# EAGLE design MirOculousShieldv2 (EAGLE 6.6.0)
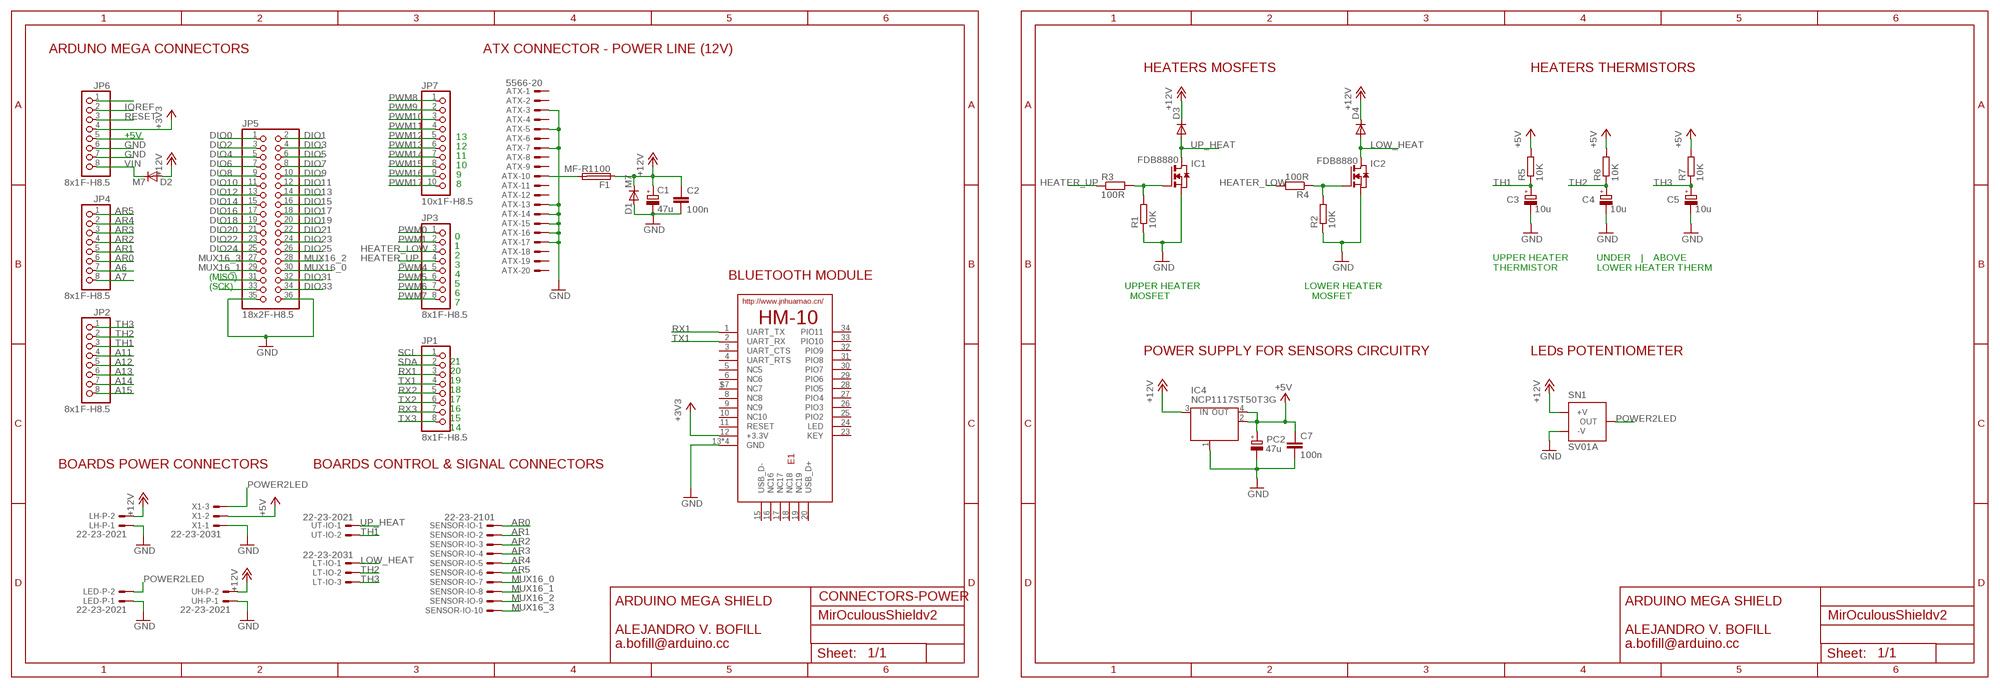
[diagram p0: schematic, sheet 1]

## Parts
ATX  5566-20  [5566-20]
C1  47u  CPOL-EUD  [PANASONIC_D]
C2  100n  C-EUC0603  [C0603]
C3  10u  CPOL-EUA/3216-18R  [A/3216-18R]
C4  10u  CPOL-EUA/3216-18R  [A/3216-18R]
C5  10u  CPOL-EUA/3216-18R  [A/3216-18R]
C7  100n  C-EUC0603  [C0603]
D1  M7  DIODE-SMB  [SMB]
D2  M7  DIODE-SMB  [SMB]
D3  RGL34A  DO-213_DIODE  [DO-213AA_DIODE]
D4  RGL34A  DO-213_DIODE  [DO-213AA_DIODE]
E1  HM-10-BOARD  [26.9X13X2.2_BOARD]
F1  MF-R1100  LITTLEFUSE  [LITTLEFUSE]
IC1  FDB8880  [FDB8880]
IC2  FDB8880  [FDB8880]
IC4  NCP1117ST50T3G  MC33269ST-3.3T3  [SOT223]
JP1  8x1F-H8.5  PINHD-1X8  [1X08]
JP2  8x1F-H8.5  PINHD-1X8  [1X08]
JP3  8x1F-H8.5  PINHD-1X8  [1X08]
JP4  8x1F-H8.5  PINHD-1X8  [1X08]
JP5  18x2F-H8.5  PINHD-2X18  [2X18]
JP6  8x1F-H8.5  PINHD-1X8  [1X08]
JP7  10x1F-H8.5  PINHD-1X10_ARD  [1X10]
LED-P  22-23-2021  [22-23-2021]
LH-P  22-23-2021  [22-23-2021]
LT-IO  22-23-2031  [22-23-2031]
PC2  47u  CPOL-EUD  [PANASONIC_D]
R1  10K  R-EU_R0603  [R0603]
R2  10K  R-EU_R0603  [R0603]
R3  100R  R-EU_R0603  [R0603]
R4  100R  R-EU_R0603  [R0603]
R5  10K  R-EU_R0603  [R0603]
R6  10K  R-EU_R0603  [R0603]
R7  10K  R-EU_R0603  [R0603]
SENSOR-IO  22-23-2101  [22-23-2101]
SN1  SV01A  [SV01A]
UH-P  22-23-2021  [22-23-2021]
UT-IO  22-23-2021  [22-23-2021]
X1  22-23-2031  [22-23-2031]

## Nets
+3V3 [power usb]: E1.12(+3.3V) JP6.4
+5V: C7.1 IC4.2(OUT) IC4.4(OUT) PC2.+ R5.2 R6.2 R7.2 X1.2
+12V [power12]: C1.+ C2.1 D1.C D2.A D3.P$2(C) D4.P$2(C) F1.1 IC4.3(IN) LH-P.2 SN1.3(+V) UH-P.2
A6: JP4.7
A7: JP4.8
A11: JP2.4
A12: JP2.5
A13: JP2.6
A14: JP2.7
A15: JP2.8
AR0: JP4.6 SENSOR-IO.1
AR1: JP4.5 SENSOR-IO.2
AR2: JP4.4 SENSOR-IO.3
AR3: JP4.3 SENSOR-IO.4
AR4: JP4.2 SENSOR-IO.5
AR5: JP4.1 SENSOR-IO.6
DIO0: JP5.1
DIO1: JP5.2
DIO2: JP5.3
DIO3: JP5.4
DIO4: JP5.5
DIO5: JP5.6
DIO6: JP5.7
DIO7: JP5.8
DIO8: JP5.9
DIO9: JP5.10
DIO10: JP5.11
DIO11: JP5.12
DIO12: JP5.13
DIO13: JP5.14
DIO14: JP5.15
DIO15: JP5.16
DIO16: JP5.17
DIO17: JP5.18
DIO18: JP5.19
DIO19: JP5.20
DIO20: JP5.21
DIO21: JP5.22
DIO22: JP5.23
DIO23: JP5.24
DIO24: JP5.25
DIO25: JP5.26
DIO30: JP5.31
DIO31: JP5.32
DIO32: JP5.33
DIO33: JP5.34
GND [gnd]: ATX.3 ATX.5 ATX.7 ATX.13 ATX.14 ATX.15 ATX.16 ATX.17 C1.- C2.2 C3.- C4.- C5.- C7.2 D1.A E1.13(GND) E1.14(GND) E1.21(GND) E1.22(GND) IC1.3(S) IC2.3(S) IC4.1(GND/ADJ) JP5.35 JP5.36 JP6.6 JP6.7 LED-P.1 LH-P.1 PC2.- R1.1 R2.1 SN1.1(-V) UH-P.1 X1.1
HEATER_LOW: JP3.3 R4.2
HEATER_UP: JP3.4 R3.1
IOREF: JP6.2
LOW_HEAT [power12]: D4.P$1(A) IC2.2(D) LT-IO.1
MUX16_0: JP5.30 SENSOR-IO.7
MUX16_1: JP5.29 SENSOR-IO.8
MUX16_2: JP5.28 SENSOR-IO.9
MUX16_3: JP5.27 SENSOR-IO.10
N$1: JP6.1
N$2: JP6.5
N$17 [power12]: ATX.10 F1.2
N$18: IC1.1(G) R1.2 R3.2
N$19: IC2.1(G) R2.2 R4.1
POWER2LED [power12]: LED-P.2 SN1.2(OUT) X1.3
PWM0: JP3.1
PWM1: JP3.2
PWM4: JP3.5
PWM5: JP3.6
PWM6: JP3.7
PWM7: JP3.8
PWM8: JP7.1
PWM9: JP7.2
PWM10: JP7.3
PWM11: JP7.4
PWM12: JP7.5
PWM13: JP7.6
PWM14: JP7.7
PWM15: JP7.8
PWM16: JP7.9
PWM17: JP7.10
RESET: JP6.3
RX1: E1.1(UART_TX) JP1.3
RX2: JP1.5
RX3: JP1.7
SCL: JP1.1
SDA: JP1.2
TH1: C3.+ JP2.3 R5.1 UT-IO.2
TH2: C4.+ JP2.2 LT-IO.2 R6.1
TH3: C5.+ JP2.1 LT-IO.3 R7.1
TX1: E1.2(UART_RX) JP1.4
TX2: JP1.6
TX3: JP1.8
UP_HEAT [power12]: D3.P$1(A) IC1.2(D) UT-IO.1
VIN: D2.C JP6.8
Unconnected: ATX.1 ATX.2 ATX.4 ATX.6 ATX.8 ATX.9 ATX.11 ATX.12 ATX.18 ATX.19 ATX.20 E1.3(UART_CTS) E1.4(UART_RTS) E1.5(NC5) E1.6(NC6) E1.8(NC8) E1.9(NC9) E1.10(NC10) E1.11(RESET) E1.15(USB_D-) E1.16(NC16) E1.17(NC17) E1.18(NC18) E1.19(NC19) E1.20(USB_D+) E1.23(KEY) E1.24(LED) E1.25(PIO2) E1.26(PIO3) E1.27(PIO4) E1.28(PIO5) E1.29(PIO6) E1.30(PIO7) E1.31(PIO8) E1.32(PIO9) E1.33(PIO10) E1.34(PIO11) E1.$7(NC7)

## Notes on the sheet
- ARDUNO MEGA CONNECTORS | ATX CONNECTOR - POWER LINE (12V)
- HEATERS MOSFETS | HEATERS THERMISTORS
- +5V | 13
- 12
- 11
- 10
- 9
- 8
- 0
- 1
- 2
- 3
- 4
- UPPER HEATER
  THERMISTOR
- UNDER    |    ABOVE
  LOWER HEATER THERM
- (MISO) | 5 | BLUETOOTH MODULE
- (SCK) | 6
- 7
- UPPER HEATER
    MOSFET
- LOWER HEATER
     MOSFET
- 21 | POWER SUPPLY FOR SENSORS CIRCUITRY | LEDs POTENTIOMETER
- 20
- 19
- 18
- 17
- 16
- 15
- 14
- BOARDS POWER CONNECTORS | BOARDS CONTROL & SIGNAL CONNECTORS
- CONNECTORS-POWER
- ARDUINO MEGA SHIELD
  
  ALEJANDRO V. BOFILL
  a.bofill@arduino.cc
- ARDUINO MEGA SHIELD
  
  ALEJANDRO V. BOFILL
  a.bofill@arduino.cc

## Library data of the parts
ATX = con-molex:5566-20: Mini FIT connector 20 pol ATX PC-Motherboard Power connector Source: http://www.molex.com; OC_FARNELL: 9734252; OC_NEWARK: unknown
C1 C3-C5 PC2 = rcl:CPOL-EU: POLARIZED CAPACITOR, European symbol
C2 C7 = rcl:C-EU: CAPACITOR, European symbol
D1 D2 = diode:DIODE-: DIODE
D3 D4 = verkstad:DO-213_DIODE: RGL34A thru RGL34K Surface Mount Glass Passivated Junction Fast Switching Rectifier
E1 = JNHuaMao:HM-10: HM Bluetooth module use TI CC2540 or CC2541, Master and slave roles in one, transmission version and remote control version and PIO state acquisition functions in one, Support the AT command modify module parameters, Convenient and flexible.
F1 = fuse:LITTLEFUSE: LITTLEFUSE Picofuse/slow Littlefuse; FARNELL: 1652183; OC_FARNELL: unknown; OC_NEWARK: unknown
IC1 IC2 = verkstad:FDB8880: FDB8880 N-Channel PowerTrench MOSFET This N-Channel MOSFET has been designed specifically to improve the overall efficiency of DC/DC converters using either synchronous or conventional switching PWM controllers. It has been optimized for low gate charge, low rDS(ON) and fast switching speed. Digikey Part Number: FDD8880CT-ND
IC4 = linear:MC33269ST*: Adjustable Output Low Dropout Voltage Regulator 800 mA Source: http://www.onsemi.com/pub/Collateral/MC33269-D.PDF
JP1-JP4 JP6 = SmartPrj:PINHD-1X8: PIN HEADER
JP5 = SmartPrj:PINHD-2X18: PIN HEADER
JP7 = SmartPrj:PINHD-1X10_ARD: PIN HEADER
LED-P LH-P UH-P UT-IO = con-molex:22-23-2021: .100" (2.54mm) Center Header - 2 Pin; MF: MOLEX; MPN: 22-23-2021; OC_FARNELL: 1462926; OC_NEWARK: 25C3832
LT-IO X1 = con-molex:22-23-2031: .100" (2.54mm) Center Header - 3 Pin; MF: MOLEX; MPN: 22-23-2031; OC_FARNELL: 1462950; OC_NEWARK: 30C0862
R1-R7 = rcl:R-EU_: RESISTOR, European symbol
SENSOR-IO = con-molex:22-23-2101: .100" (2.54mm) Center Header - 10 Pin; MF: MOLEX; MPN: 22-23-2101; OC_FARNELL: 1756828; OC_NEWARK: 94C0765
SN1 = murata-sensor:SV01: Rotary Position Sensors SMD/Lead Dust-proof Type 12mm Size SV01 Series Source: http://www.murata.com/catalog/r50/el0595.pdf; OC_FARNELL: 1406648; OC_NEWARK: unknown

## Net classes
0 default: width 0.254 mm, drill 0.406 mm, clearance 0.203 mm
1 power: width 0.61 mm, drill 0.406 mm, clearance 0.203 mm
2 gnd: width 0.305 mm, drill 0.406 mm, clearance 0.203 mm
3 power usb: width 0.508 mm, drill 0.406 mm, clearance 0.203 mm
4 power12: width 1.905 mm, drill 0.813 mm, clearance 0.203 mm

## Board
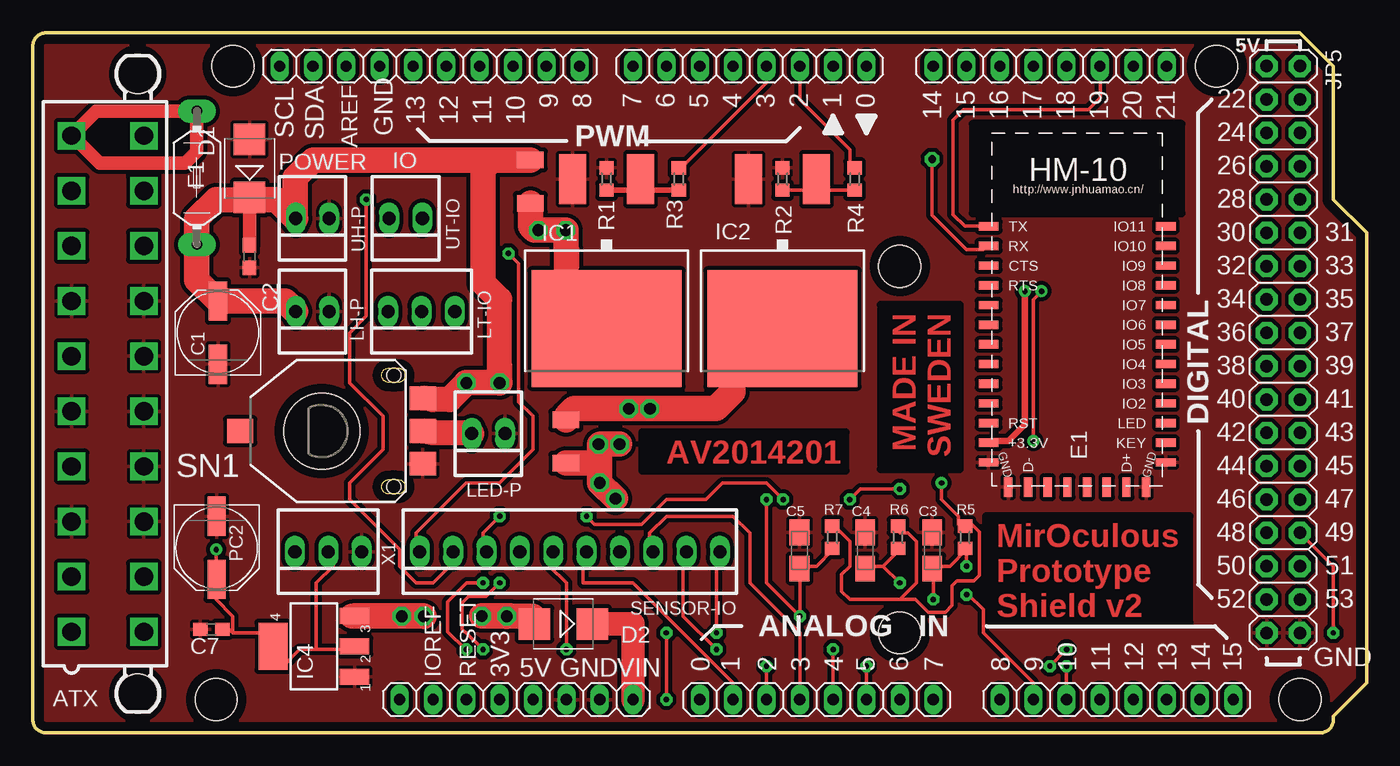
[diagram p1: board, top side]
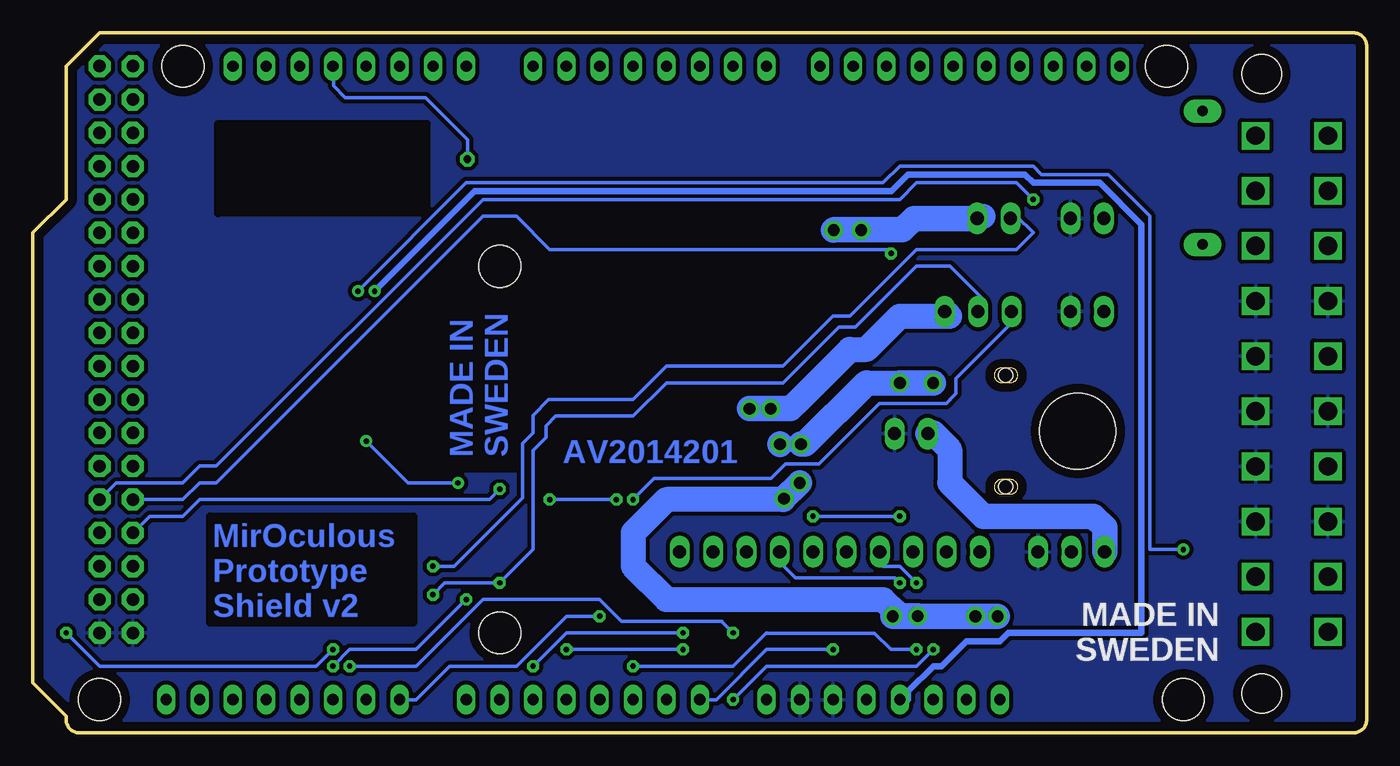
[diagram p2: board, bottom side, seen from below]

Size 101.6 x 53.34 mm. Coordinates in mm from the lower left corner, seen from the top.
Outline: 96.52,53.34 99.06,50.8 99.06,40.64 101.6,38.1 101.6,3.81 99.06,1.27 99.06,1 arc-90 98.06,0 1,0 arc-90 0,1 0,52.34 arc-90 1,53.34 96.52,53.34
Copper layers (1*16): Top 0.035mm / dielectric 1.5mm / Bottom 0.035mm
Design rules "default": minimum track width 8mil, minimum drill 16mil, track to track 7mil, track to pad 7mil, pad to pad 8mil, via to via 10mil, smd to smd 7mil, copper to edge 27mil, drill to drill 12mil, minimum pad ring 10mil, minimum via ring 10mil, stop-mask expansion 2mil, vias tented up to drill 24mil, thermal gap 10mil
Holes 3.2 mm at 96.52,2.54 15.24,50.8 90.17,50.8 13.97,2.54 66.04,35.56 66.04,7.62
tRestrict: area 64.6,20.1 to 70.6,32.6; area 46.4,20 to 61.9,22.9; area 72.6,8.4 to 88.1,16.5; area 71.6,39.6 to 87.5,46.4
bRestrict: area 64.6,20.1 to 70.6,32.6; area 46.4,20 to 61.9,22.9; area 72.6,8.4 to 88.1,16.5; area 71.6,39.6 to 87.5,46.4

### Footprints (pad centres in the part's own frame; a part is rotated, then mirrored left to right if it is on the bottom)
5566-20 = drill 1.4 square: 1 18.9,-2.75; 2 14.7,-2.75; 3 10.5,-2.75; 4 6.3,-2.75; 5 2.1,-2.75; 6 -2.1,-2.75; 7 -6.3,-2.75; 8 -10.5,-2.75; 9 -14.7,-2.75; 10 -18.9,-2.75; 11 18.9,2.75; 12 14.7,2.75; 13 10.5,2.75; 14 6.3,2.75; 15 2.1,2.75; 16 -2.1,2.75; 17 -6.3,2.75; 18 -10.5,2.75; 19 -14.7,2.75; 20 -18.9,2.75 | hole 3: 23.6,2.29; -23.6,2.29
PANASONIC_D = smd 3 x 1.4: + 2.4,0; - -2.4,0
C0603 = smd 1.1 x 1: 1 -0.85,0; 2 0.85,0
A/3216-18R = smd 1.95 x 1.5: + 1.375,0; - -1.375,0
SMB = smd 2.4 x 2.4: A 2.2,0; C -2.2,0
DO-213AA_DIODE = smd 1.27 x 2.032: P$1 -1.651,0; P$2 1.651,0
26.9X13X2.2_BOARD = smd 1.5 x 0.635: 1 -7.5,0; 2 -7.5,-1.5; 3 -7.5,-3; 4 -7.5,-4.5; 5 -7.5,-6; 6 -7.5,-7.5; 8 -7.5,-10.5; 9 -7.5,-12; 10 -7.5,-13.5; 11 -7.5,-15; 12 -7.5,-16.5; 13 -7.5,-18; 22 6,-18; 23 6,-16.5; 24 6,-15; 25 6,-13.5; 26 6,-12; 27 6,-10.5; 28 6,-9; 29 6,-7.5; 30 6,-6; 31 6,-4.5; 32 6,-3; 33 6,-1.5; 34 6,0; $7 -7.5,-9 | smd 0.635 x 1.5: 14 -6,-19.875; 15 -4.5,-19.875; 16 -3,-19.875; 17 -1.5,-19.875; 18 0,-19.875; 19 1.5,-19.875; 20 3,-19.875; 21 4.5,-19.875
LITTLEFUSE = drill 0.813 pad 1.778 long: 1 -5.08,0; 2 5.08,0
FDB8880 = smd 2.032 x 3.81: 1 -2.595,-8.89; 3 2.595,-8.89 | smd 11.43 x 8.89: 2 0,2.5
SOT223 = smd 1.219 x 2.235: 1 -2.311,-3.099; 2 0,-3.099; 3 2.311,-3.099 | smd 3.6 x 2.2: 4 0,3.099
1X08 = drill 0.85 pad 1.422 long: 1 -8.89,0; 2 -6.35,0; 3 -3.81,0; 4 -1.27,0; 5 1.27,0; 6 3.81,0; 7 6.35,0; 8 8.89,0
2X18 = drill 0.95 pad 1.676 octagon: 1 -21.59,-1.27; 2 -21.59,1.27; 3 -19.05,-1.27; 4 -19.05,1.27; 5 -16.51,-1.27; 6 -16.51,1.27; 7 -13.97,-1.27; 8 -13.97,1.27; 9 -11.43,-1.27; 10 -11.43,1.27; 11 -8.89,-1.27; 12 -8.89,1.27; 13 -6.35,-1.27; 14 -6.35,1.27; 15 -3.81,-1.27; 16 -3.81,1.27; 17 -1.27,-1.27; 18 -1.27,1.27; 19 1.27,-1.27; 20 1.27,1.27; 21 3.81,-1.27; 22 3.81,1.27; 23 6.35,-1.27; 24 6.35,1.27; 25 8.89,-1.27; 26 8.89,1.27; 27 11.43,-1.27; 28 11.43,1.27; 29 13.97,-1.27; 30 13.97,1.27; 31 16.51,-1.27; 32 16.51,1.27; 33 19.05,-1.27; 34 19.05,1.27; 35 21.59,-1.27; 36 21.59,1.27
1X10 = drill 0.85 pad 1.422 long: 1 -11.43,0; 2 -8.89,0; 3 -6.35,0; 4 -3.81,0; 5 -1.27,0; 6 1.27,0; 7 3.81,0; 8 6.35,0; 9 8.89,0; 10 11.43,0
22-23-2021 = drill 1 long: 1 -1.27,0; 2 1.27,0
22-23-2031 = drill 1 long: 1 -2.54,0; 2 0,0; 3 2.54,0
R0603 = smd 1 x 1.1: 1 -0.85,0; 2 0.85,0
22-23-2101 = drill 1 long: 1 -11.43,0; 2 -8.89,0; 3 -6.35,0; 4 -3.81,0; 5 -1.27,0; 6 1.27,0; 7 3.81,0; 8 6.35,0; 9 8.89,0; 10 11.43,0
SV01A = smd 1.8 x 2: 1 -2.5,-7.7; 2 0,-7.7; 2@1 0,6.2; 3 2.5,-7.7 | hole 5.8: 0,0 | hole 1.1: 4.25,-5.5; -4.25,-5.5

### Placement (x,y rotation side)
ATX  5.7,26.6 270 top
C1  14.1,30.5 90 top
C2  16.5,36.3 270 top
C3  68.5,13.9 270 top
C4  63.4,13.9 270 top
C5  58.4,13.9 270 top
C7  13.6,7.9 180 top
D1  16.5,43 90 top
D2  40.4,8.3 180 top
D3  37.9,42 90 top
D4  40.6,22.2 270 top
E1  80.3,38.6 0 top
F1  12.5,42.3 90 top
IC1  43.7,33.3 180 top
IC2  57.1,33.3 180 top
IC4  21.4,6.6 90 top
JP1  77.47,50.8 180 top
JP2  82.55,2.54 0 top
JP3  54.61,50.8 180 top
JP4  59.69,2.54 0 top
JP5  95.25,29.21 270 top
JP6  36.83,2.54 0 top
JP7  30.23,50.8 0 top
LED-P  34.7,22.8 180 top
LH-P  21.3,32.1 180 top
LT-IO  29.6,32.1 180 top
PC2  14,14.1 270 top
R1  43.7,42.2 270 top
R2  57.1,42.2 270 top
R3  49.2,42.2 270 top
R4  62.6,42.2 90 top
R5  71,14.9 90 top
R6  65.9,14.9 90 top
R7  60.9,14.9 90 top
SENSOR-IO  40.9,13.8 180 top
SN1  22,23 90 top
UH-P  21.3,39.2 180 top
UT-IO  28.4,39.2 180 top
X1  22.5,13.8 180 top

### Tracks (layer width: path | path; a pad name or v marks a point on that pad's centre or on a via)
+3V3  (via drill 0.41)
  Top 0.508: v75.56,33.66 75.56,23.5 74.3,22.23 73.03,22.23 E1.12
  Bottom 0.508: v75.56,33.66 67.94,41.27 36.2,41.27 34.92,42.55 26.04,42.55 25.4,41.91 20.32,41.91 17.14,38.73 17.14,7.62 27.3,7.62 27.94,6.99 30.48,6.99 32.38,5.08 33.02,5.08 34.92,3.17 34.92,2.54 JP6.4
+5V  (via drill 0.41)
  Top 0.203: 13.97,11.43 PC2.+
  Top 0.254: 13.97,11.43 13.97,10.16 15.24,8.89 15.24,7.62 | 21.59,6.35 20.32,6.35 19.05,5.08 17.78,5.08 17.78,6.35 IC4.4 17.78,7.62 15.24,7.62 | 21.59,6.35 24.13,6.35 IC4.2 | 21.59,6.35 21.59,11.43 22.86,12.7 X1.2 | 66.04,10.16 62.23,10.16 61.59,10.79 61.59,12.06 62.23,12.7 62.23,14.61 60.96,15.88 R7.2 | 66.04,10.16 67.31,11.43 67.31,14.61 66.67,15.24 66.04,15.24 66.04,15.88 R6.2 | 70.48,15.88 70.48,16.51 69.22,17.78 v69.22,19.05 | 70.48,15.88 R5.2 | v76.2,22.23 76.2,33.02 v76.83,33.66 | v13.97,13.97 13.97,12.06 PC2.+ | 70.48,15.88 71.53,15.88 72.1,15.3 72.1,12 71.7,11.6 70.4,11.6 70,11.2 70,9.7 69.5,9.2 68.2,9.2 67.24,10.16 66.04,10.16 | 15.24,7.62 14.96,7.9 C7.1
  Bottom 0.254: v69.22,19.05 73.03,19.05 v76.2,22.23 | v76.83,33.66 68.58,41.91 36.83,41.91 35.56,43.18 25.4,43.18 24.77,42.55 19.68,42.55 16.51,39.37 16.51,13.97 v13.97,13.97
+12V  (via drill 0.9)
  Top 0.203: v43.1,22 43.1,22.07 | 34.6,42.91 34.29,42.6
  Top 0.254: 43.1,22.07 42.63,22.54 44.16,22.54 v44.7,22
  Top 0.61: 33,26.7 33,26.69 v33.02,26.67
  Top 1.016: C2.1 D1.C
  Top 1.905: 13.97,40.64 16.51,40.64 D1.C | v36.1,8.89 38.1,8.89 D2.A | 24.3,8.89 IC4.3 | v33.02,26.67 31.75,25.4 30.48,25.4 SN1.3 | 34.29,34.29 35.56,33.02 35.56,27.94
  Top 1.93: 34.29,34.29 34.29,42.6 34.29,43 | 34.29,43 34.29,43.18 34.76,43.65 34.94,43.65 | 34.94,43.65 D3.P$2 21.35,43.65 20,42.3 20,39.2 UH-P.2 18.59,40.64 16.51,40.64 | 34.94,43.65 34.29,43 | IC4.3 29.78,8.91 v29.8,8.89 | v36.1,8.89 36.39,8.9 v34.2,8.9 | 43.18,21 v43.18,19.05 v44.38,17.85 | 43.18,21 43.18,21.9 | 43.18,21.9 43.18,21.99 | D4.P$2 43.13,20.55 43.18,21 | v44.7,22 43.28,22 43.18,21.9 | LH-P.2 19.23,32.9 C1.+ 12.5,34.5 F1.1 12.5,39.17 13.97,40.64 | 35.56,27.94 v35.56,26.67 | 33,26.7 35.6,26.7
  Bottom 0.254: 43.18,21.99 v44.69,21.99 | v44.7,22 v43.1,22 42.77,22
  Bottom 1.905: 38.1,26.67 v35.56,26.67 | 35.56,8.89 35.84,9.16 36.83,10.16 53.34,10.16 55.88,12.7 55.88,15.24 53.34,17.78 44.45,17.78 v43.18,19.05
  Bottom 1.93: v36.1,8.89 v29.8,8.89 v28.11,8.89 | v34.2,8.9 35.57,8.9 35.84,9.16 | v44.69,21.99 v44.7,22 | v35.56,26.67 v33.02,26.67 | 43.07,22 v43.1,22 | 38.1,26.67 42.77,22
AR0  (via drill 0.41)
  Top 0.254: v63.5,5.08 JP4.6 | v52.07,7.62 52.07,12.7 SENSOR-IO.1
  Bottom 0.254: v63.5,5.08 60.96,7.62 v52.07,7.62
AR1  (via drill 0.41)
  Top 0.254: v60.96,6.35 JP4.5 | v52.07,6.35 49.53,8.89 49.53,12.7 SENSOR-IO.2
  Bottom 0.254: v52.07,6.35 v60.96,6.35
AR2
  Top 0.254: JP4.4 58.42,7.62 54.61,11.43 54.61,15.24 53.34,16.51 48.26,16.51 46.99,15.24 46.99,13.97 SENSOR-IO.3
AR3  (via drill 0.41)
  Top 0.254: v55.88,5.08 JP4.3 | v35.56,11.43 34.53,10.4 33.2,10.4 32.7,9.9 32.7,7.9 32.9,7.7 32.94,7.7 v34.29,6.35
  Bottom 0.254: v55.88,5.08 48.26,5.08 45.72,7.62 45.7,7.6 37.5,7.6 36.25,6.35 v34.29,6.35 | v35.56,11.43 35.93,11.8 43.5,11.8 44.71,13.01 SENSOR-IO.4
AR4
  Top 0.254: JP4.2 53.34,3.81 45.72,11.43 41.91,11.43 41.91,12.7 SENSOR-IO.5
AR5  (via drill 0.41)
  Top 0.254: v40.64,6.35 40.64,11.43 39.37,12.7 SENSOR-IO.6
  Bottom 0.254: JP4.1 49.53,2.54 45.72,6.35 v40.64,6.35
GND
  pour Top (isolate 0.305, rank 2): 0.64,52.7 101.6,52.7 101.6,0.64 0.64,0.64 0.64,29.84 0.59,28.75 0.59,45.85 0.64,46.35
  pour Bottom (isolate 0.305, rank 2): 0.64,52.7 101.6,52.7 102.23,52.07 102.23,0.64 1.27,0.64 0.64,1.27 0.64,29.84 0.49,29.84 0.59,45.76 0.64,46.35
HEATER_LOW
  Top 0.254: JP3.3 58.42,48.26 62.23,44.45 62.23,43.18 R4.2
HEATER_UP
  Top 0.254: JP3.4 55.88,49.53 49.53,43.18 R3.1
LOW_HEAT  (via drill 0.9)
  Top 1.905: 53.34,26 53.34,29.21 55.88,31.75 IC2.2
  Top 1.93: 53.34,26 52.04,24.7 v47,24.7 41.21,24.7 40.64,24.13 40.64,23.89 D4.P$1
  Bottom 1.905: 43.18,25.4 39.37,29.21 38.1,29.21 35.56,31.75 31.75,31.75 LT-IO.1
  Bottom 1.93: 43.18,25.4 43.88,24.7 v45.4,24.7 v47,24.7
MUX16_0  (via drill 0.41)
  Top 0.254: v48.26,7.62 v48.26,2.54 | v78.74,6.35 v77.47,5.08 | v99.06,7.62 99.06,12.7 JP5.30 | v34.29,11.43 33.03,11.43 31.6,10 31.6,7.7 32.95,6.35 v33.02,6.35
  Bottom 0.254: v34.29,11.43 35.56,12.7 36.83,12.7 SENSOR-IO.7 | v33.02,6.35 34.29,5.08 45.72,5.08 v48.26,2.54 | v77.47,5.08 72.39,5.08 67.31,10.16 58.42,10.16 56.76,8.5 49.1,8.5 49.1,8.46 v48.26,7.62 | v78.74,6.35 80.01,5.08 96.52,5.08 v99.06,7.62
MUX16_1  (via drill 0.41)
  Top 0.254: v35.56,16.51 34.29,15.24 34.29,13.97 SENSOR-IO.8 | v57.15,17.78 55.88,19.05 52.55,19.05 51.28,17.78 48.26,17.78 46.38,15.9 42.79,15.9 v42.18,16.51 | v62.23,17.78 63.03,18.58 v66.04,18.58
  Bottom 0.254: v42.18,16.51 v35.56,16.51 | v62.23,17.78 v57.15,17.78 | JP5.29 92.71,16.51 90.17,16.51 88.88,17.8 66.82,17.8 v66.04,18.58
MUX16_2  (via drill 0.41)
  Top 0.254: v25.4,40.64 25.4,31.75 24.13,30.48 24.13,26.67 26.67,24.13 26.67,21.59 24.13,19.05 24.13,17.78 27.94,13.97 27.94,12.7 29.21,11.43 30.48,11.43 31.75,12.7 SENSOR-IO.9
  Bottom 0.254: v25.4,40.64 26.67,41.91 34.29,41.91 35.56,40.64 67.31,40.64 87.63,20.32 88.9,20.32 90.17,19.05 95.25,19.05 JP5.28
MUX16_3  (via drill 0.41)
  Top 0.254: SENSOR-IO.10 29.21,13.97 29.21,15.24 33.02,19.05 35.56,19.05 38.1,21.59 38.1,24.13 37,25.23 37,35.7 37,35.76 v36.23,36.53
  Bottom 0.254: JP5.27 90.17,17.78 88.9,19.05 87.63,19.05 67.31,39.37 64.77,39.37 62.23,36.83 36.53,36.83 v36.23,36.53
N$3
  Top 1.016: 3,45.5 5.1,43.4 11.6,43.4 12.5,44.3 12.5,47.4
N$17
  Top 1.016: ATX.10 4.83,47.38 F1.2
N$18
  Top 0.406: R1.2 46.3,41.35 IC1.1 47.13,41.35 R3.2
N$19
  Top 0.203: 58.85,41.35 IC2.1 60.53,41.35
  Top 0.254: R2.2 58.85,41.35 | 60.53,41.35 R4.1
POWER2LED
  Top 1.905: SN1.2 30.48,22.86 33.02,22.86 LED-P.2
  Bottom 1.905: 29.21,16.51 31.75,19.05 31.75,21.59 33.02,22.86 LED-P.2
  Bottom 1.93: 29.21,16.51 20.81,16.51 19.96,15.66 X1.3
RX1
  Top 0.254: E1.1 71,38.6 70.1,39.5 70.1,46.7 70.9,47.5 80.4,47.5 81.3,48.4 81.3,50.78 JP1.3
TH1  (via drill 0.41)
  Top 0.254: 71.12,13.97 69.85,12.7 68.58,12.7 | v78.74,5.08 JP2.3 | 68.58,12.7 v68.58,10.16 | 68.58,12.7 C3.+ | 71.12,13.97 v71.12,12.7 | 71.12,13.97 R5.1
  Bottom 0.254: v78.74,5.08 77.47,6.35 72.39,6.35 v68.58,10.16 | v71.12,12.7 69.5,12.7 64.3,17.9 64.3,22.06 63.5,22.86 63.5,24.2 62.3,25.4 55.88,25.4 53.34,27.94 44.45,27.94 40.64,31.75 39.37,31.75 34.29,36.83 26.67,36.83 25.4,38.1 26.67,39.37 UT-IO.2
TH2  (via drill 0.41)
  Top 0.254: 64.77,12.7 66.04,13.97 R6.1 | 64.77,12.7 63.5,12.7 C4.+ | JP2.2 76.2,3.81 72.39,7.62 72.39,9.4 71.26,10.53 v71.12,10.53 | 64.77,12.7 v66.04,11.43
  Bottom 0.254: LT-IO.2 29.21,33.02 31.75,35.56 34.29,35.56 38.92,30.93 40.2,30.93 44.45,26.67 53.34,26.67 55.88,24.13 61.77,24.13 62.5,23.4 62.5,22.5 63.5,21.5 63.5,13.97 v66.04,11.43 70.22,11.43 v71.12,10.53
TH3  (via drill 0.41)
  Top 0.254: 58.42,12.7 59.69,12.7 60.96,13.97 R7.1 | 58.42,12.7 v58.42,8.89 55.88,11.43 v55.88,17.78 | 58.42,12.7 C5.+
  Bottom 0.254: JP2.1 72.39,2.54 69.85,5.08 64.77,5.08 60.96,8.89 v58.42,8.89 | v55.88,17.78 54.27,19.39 45.38,19.39 44.27,20.5 41.73,20.5 37.13,25.1 32,25.1 31.75,25.35 31.75,25.4 31.3,25.85 31.3,27 27.06,31.24 LT-IO.3
TX1  (via drill 0.6)
  Top 0.254: E1.2 72.39,36.83 71.12,36.83 68.5,39.45 v68.5,43.7
  Bottom 0.254: v68.5,43.7 68.5,45.2 71.7,48.4 77.8,48.4 78.7,49.3 78.7,50.76 JP1.4
UP_HEAT  (via drill 0.9)
  Top 1.905: 40.64,35.56 40.64,31.75 41.91,30.48 43.18,30.48 IC1.2
  Top 1.93: 40.64,35.56 40.64,36.83 40.6,36.87 v40.6,38.3 v38.5,38.3 | v38.5,38.3 38.2,38.3 37.9,38.6 37.9,38.7 | 37.9,38.7 D3.P$1 | v38.5,38.3 38.1,38.7 37.9,38.7
  Bottom 1.905: 29.21,39.37 UT-IO.1
  Bottom 1.93: v40.6,38.3 40.55,38.35 35.35,38.35 34.5,39.2 UT-IO.1
VIN
  Top 1.778: D2.C 45.72,8.3 JP6.8

### Text on the board
Top: MADE IN / SWEDEN | AV2014201 | MirOculous / Prototype / Shield v2
Bottom: AV2014201 | MADE IN / SWEDEN | MirOculous / Prototype / Shield v2
tPlace: 9 | 8 | 7 | 6 | 5 | 4 | 3 | 2 | 1 | 0 | 22 | 14 | 15 | 16 | 17 | 18 | 19 | 20 | 21 | 13 | 12 | 11 | 10 | 24 | 26 | 28 | 30 | 31 | 32 | 33 | 34 | 35 | 36 | 37 | 38 | 39 | 40 | 41 | 42 | 43 | 44 | 45 | 46 | 47 | 48 | 49 | 50 | 51 | 52 | 53 | 0 | 1 | 2 | 3 | 4 | 5 | 6 | 7 | 8 | 9 | 10 | 11 | 12 | 13 | 14 | 15
tNames: 5V | SCL | SDA | AREF | GND | PWM | POWER | IO | DIGITAL | ANALOG IN | GND | IOREF | RESET | 3V3 | 5V | GND | VIN
bNames: MADE IN / SWEDEN